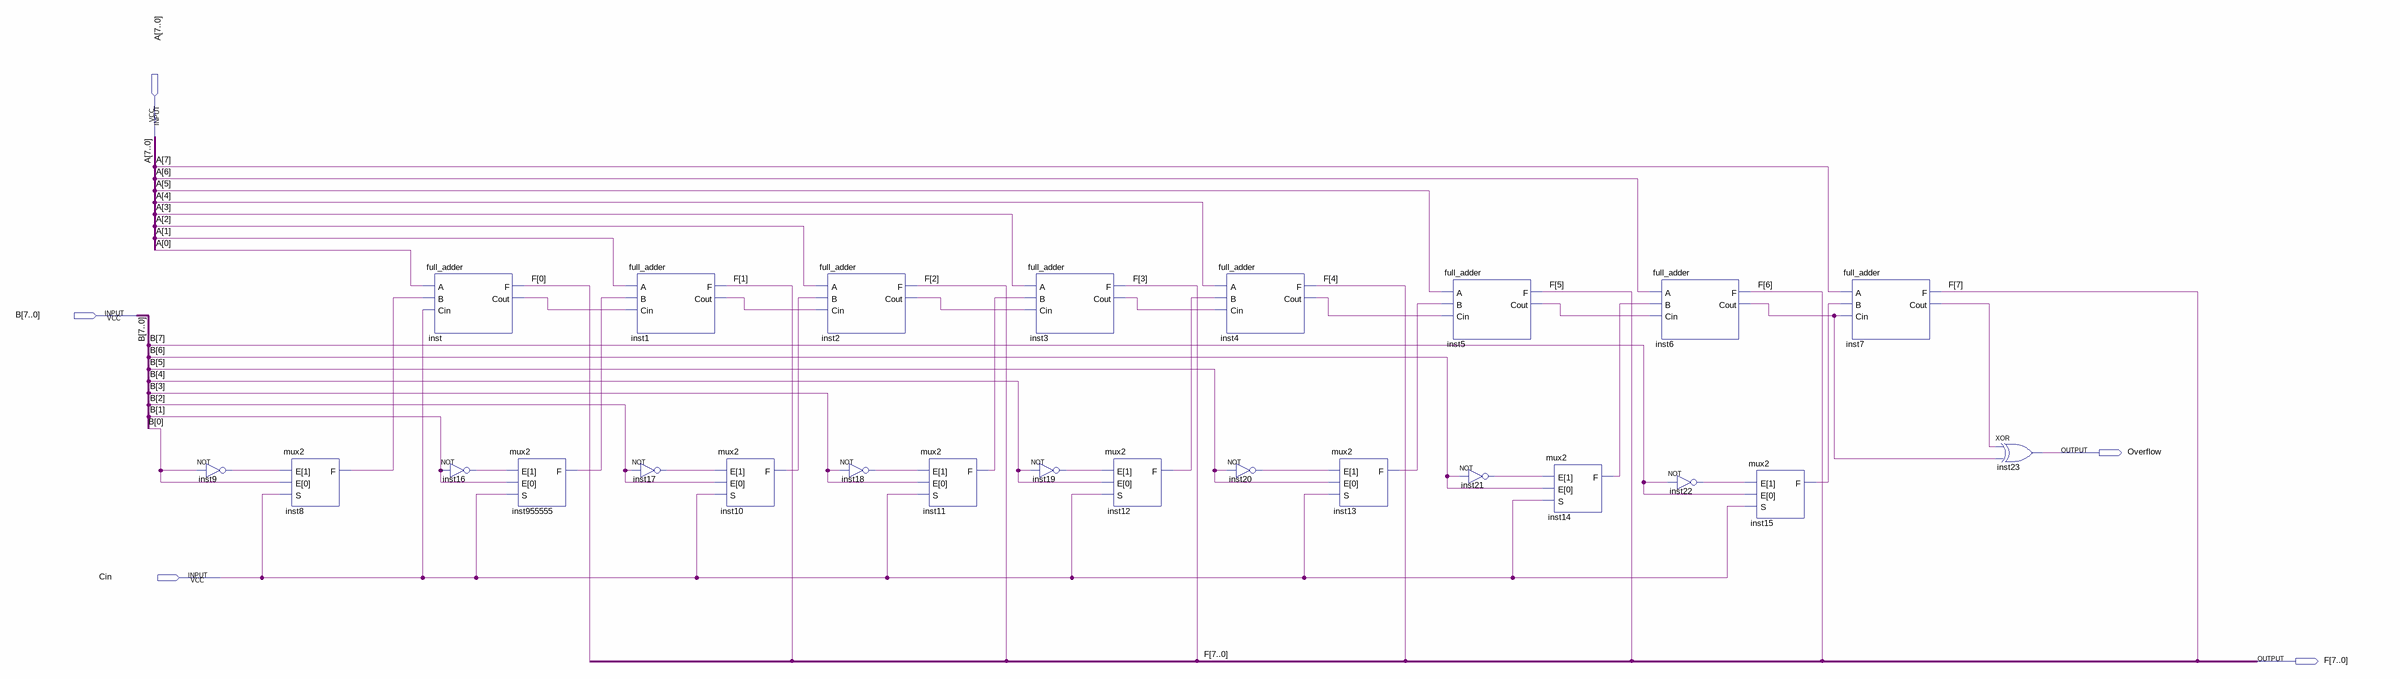
[diagram p0: schematic sheet]
// Quartus schematic somador8.bdf as structural Verilog: 25 symbols, 5 pins
module somador8 (
  input  [7:0] A,
  input  [7:0] B,
  input  Cin,
  output Overflow,
  output [7:0] F
);

  wire inst1_cout, inst2_cout, inst3_cout, inst4_cout, inst5_cout, inst6_cout, inst7_cout, inst8_f,
       inst9_out, inst10_f, inst11_f, inst12_f, inst13_f, inst14_f, inst15_f, inst16_out, inst17_out,
       inst18_out, inst19_out, inst20_out, inst21_out, inst22_out, inst955555_f, inst_cout;

  not inst9 (inst9_out, B[0]);
  mux2 inst8 (.E({inst9_out, B[0]}), .S(Cin), .F(inst8_f));
  full_adder inst (.A(A[0]), .B(inst8_f), .Cin(Cin), .F(F[0]), .Cout(inst_cout));
  not inst16 (inst16_out, B[1]);
  mux2 inst955555 (.E({inst16_out, B[1]}), .S(Cin), .F(inst955555_f));
  full_adder inst1 (.A(A[1]), .B(inst955555_f), .Cin(inst_cout), .F(F[1]), .Cout(inst1_cout));
  not inst17 (inst17_out, B[2]);
  mux2 inst10 (.E({inst17_out, B[2]}), .S(Cin), .F(inst10_f));
  full_adder inst2 (.A(A[2]), .B(inst10_f), .Cin(inst1_cout), .F(F[2]), .Cout(inst2_cout));
  not inst18 (inst18_out, B[3]);
  mux2 inst11 (.E({inst18_out, B[3]}), .S(Cin), .F(inst11_f));
  full_adder inst3 (.A(A[3]), .B(inst11_f), .Cin(inst2_cout), .F(F[3]), .Cout(inst3_cout));
  not inst19 (inst19_out, B[4]);
  mux2 inst12 (.E({inst19_out, B[4]}), .S(Cin), .F(inst12_f));
  full_adder inst4 (.A(A[4]), .B(inst12_f), .Cin(inst3_cout), .F(F[4]), .Cout(inst4_cout));
  not inst20 (inst20_out, B[5]);
  mux2 inst13 (.E({inst20_out, B[5]}), .S(Cin), .F(inst13_f));
  full_adder inst5 (.A(A[5]), .B(inst13_f), .Cin(inst4_cout), .F(F[5]), .Cout(inst5_cout));
  not inst21 (inst21_out, B[6]);
  mux2 inst14 (.E({inst21_out, B[6]}), .S(Cin), .F(inst14_f));
  full_adder inst6 (.A(A[6]), .B(inst14_f), .Cin(inst5_cout), .F(F[6]), .Cout(inst6_cout));
  not inst22 (inst22_out, B[7]);
  mux2 inst15 (.E({inst22_out, B[7]}), .S(Cin), .F(inst15_f));
  full_adder inst7 (.A(A[7]), .B(inst15_f), .Cin(inst6_cout), .F(F[7]), .Cout(inst7_cout));
  xor inst23 (Overflow, inst7_cout, inst6_cout);
endmodule
